# Altium schematic sheet ControllerWaveyRadar.SchDoc: Controller WaveyRadar Schematic
size Letter; Author: Will Vu; CompanyName: Raccoon Wireless; DrawnBy: Will Vu, Raccoon Wireless; Engineer: Will Vu; Organization: Raccoon Wireless; DocumentNumber: 2-15; Revision: 2; SheetNumber: 15; SheetTotal: 15
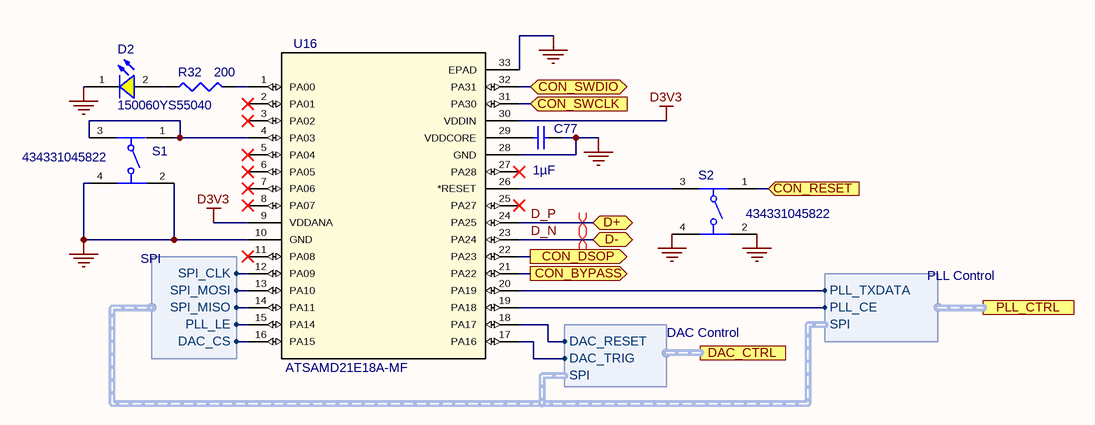
[diagram p0: ControllerWaveyRadar.SchDoc]

## Parts
C77  value 1µF  [CAPC0402(1005)60_L]  (hidden comment: Capacitor 1µF +/-20% 10V 0402)
D2  150060YS55040  [WL-SMCD_0603]
R32  value 200  [RESC0402(1005)_L]  (hidden comment: Resistor 200R +/-5 % 0402 63 mW)
S1  434331045822  [434331045822]
S2  434331045822  [434331045822]
U16  ATSAMD21E18A-MF  [QFN32_5X5MC_MCH]

## Ports
CON_BYPASS (out), CON_DSOP (out), CON_RESET (in), CON_SWCLK (in), CON_SWDIO (bidir), D+ (bidir), D- (bidir), DAC_CTRL (harness DAC Control), PLL_CTRL (harness PLL Control)

## Harnesses
PLL Control: PLL_CE, PLL_TXDATA, SPI
DAC Control: SPI, DAC_RESET, DAC_TRIG
SPI: SPI_MOSI, SPI_CLK, PLL_LE, SPI_MISO, DAC_CS

## Nets
D3V3: U16.9(VDDANA) U16.30(VDDIN)
GND: C77.2 D2.1(K) S1.2 S1.4 S2.2 S2.4 U16.10(GND) U16.28(GND) U16.33(EPAD)
CON_BYPASS: U16.21(PA22) ; port CON_BYPASS
CON_DSOP: U16.22(PA23) ; port CON_DSOP
CON_RESET: S2.1 ; port CON_RESET
CON_SWCLK: U16.31(PA30) ; port CON_SWCLK
CON_SWDIO: U16.32(PA31) ; port CON_SWDIO
D_N: U16.23(PA24) ; port D-
D_P: U16.24(PA25) ; port D+
NetC77_1: C77.1 U16.29(VDDCORE)
NetD2_2: D2.2(A) R32.1
NetR32_2: R32.2 U16.1(PA00)
NetS1_1: S1.1 S1.3 U16.4(PA03)
NetS2_3: S2.3 U16.26(*RESET)
NetU16_12: U16.12(PA09) ; harness SPI.SPI_CLK
NetU16_13: U16.13(PA10) ; harness SPI.SPI_MOSI
NetU16_14: U16.14(PA11) ; harness SPI.SPI_MISO
NetU16_15: U16.15(PA14) ; harness SPI.PLL_LE
NetU16_16: U16.16(PA15) ; harness SPI.DAC_CS
NetU16_17: U16.17(PA16) ; port DAC_CTRL.DAC_TRIG
NetU16_18: U16.18(PA17) ; port DAC_CTRL.DAC_RESET
NetU16_19: U16.19(PA18) ; port PLL_CTRL.PLL_CE
NetU16_20: U16.20(PA19) ; port PLL_CTRL.PLL_TXDATA

Not connected (* = marked no-connect by the designer): U16 2(PA01)* 3(PA02)* 5(PA04)* 6(PA05)* 7(PA06)* 8(PA07)* 11(PA08)* 25(PA27)* 27(PA28)*

## Layout directives
differential pair: D_N, D_P

## Notes on the sheet
- /

## Library data of the parts
C77 = CMP-001-00063-4: Chip Capacitor, 1µF +/-20%, 10V, 0402, Thickness 0.6 mm; Tolerance: 10%; Max Operating Temperature: 85°C; Mounting Technology: SMT; Pins: 2; Min Operating Temperature: -55°C; Voltage Rating: 10V; Case/Package: 0402
D2 = CMP-072-000005-2: WL-SMCD SMT Mono-color Chip LED Diffused, size 0603, Yellow, 2V, 140deg; Chip Technology: AlInGaP; Dominant Wavelength: 589nm; Luminous Intensity: 100mcd; Peak Wavelength: 591nm; ComponentLink1Description: Manufacturer; Publisher: Wurth Elektronik; Part Number: 150060YS55040; Design Item ID: 150060YS55040; Viewing Angle: 140deg; ComponentLink1URL: http://www.we-online.de; Emitting Color: Yellow; ComponentLink2URL: https://katalog.we-online.de/led/datasheet/150060YS55040.pdf; Packaging: Tape and Reel; ComponentLink2Description: Datasheet; Source: WL-SMCD.SchLib; Mounting Technology: SMT; Published Date: October 2019; Operating Temperature: -40 to +85degC; Forward Voltage: 2V; Size: 0603
R32 = CMP-009-00161-4: Chip Resistor, 200 Ohms, +/-5 %, 63 mW, -55 to 155 degC, 0402; Power: 63mW; Tolerance: 5%; Pins: 2; Max Operating Temperature: 155°C; Min Operating Temperature: -55°C; Case/Package: 0402
S1 S2 = CMP-083-000001-1: WS-TASU SMT Tact Switch 4.7x3.5mm side push, height 1.65mm, 220gf; Manufacturer: Wurth Elektronik; Rated Voltage: 12VDC; Washable: No; Rated Current: 50mA; Terminal Material: Copper Alloy; ComponentLink1URL: http://www.we-online.de; Operating Temperature: -40 to +85degC; Design Item ID: 434331045822; ComponentLink1Description: Manufacturer; Published Date: January 2021; Terminal Plating: Silver; Height: 1.65mm; Mounting Technology: SMT; ComponentLink2URL: https://www.we-online.com/catalog/datasheet/434331045822.pdf; ComponentLink2Description: Datasheet; Operation Force: 220gf; Contact Plating: Silver; Contact Material: Stainless Steel; Source: WS-TASU.SchLib; Packaging: Tape and Reel; Manufacturer Part Number: 434331045822
U16 = CMP-056-000000-3: No Description Available; Built_By: EMA_Molly; SourceLibrary: Microchip_2019-08-23_25; Vendor: Microchip; Type: DEV; Manufacturer_Part_Number: ATSAMD21E18A-MF; Design Item ID: ATSAMD21E18A-MF; RefDes: RefDes; Source: 2021-06-30_23-48-05.SchLib; Copyright: Copyright (C) 2018 Accelerated Designs. All rights reserved